# Altium schematic sheet IO_Peripherals.SchDoc: Peripherals
size A4; Date: Not used; ApprovedBy: Not used; CheckedBy: Not used; Author: Not used; CompanyName: STMicroelectronics; DrawnBy: Not used; Engineer: Not used; Organization: Not used; Address1: Not used; Address2: Not used; Address3: Not used; Address4: Not used; Revision: Not used; SheetNumber: 7; SheetTotal: 8; CurrentTime: Not used; CurrentDate: Not used; Time: Not used; DocumentFullPathAndName: Not used; DocumentName: Not used; ModifiedDate: Not used; ImagePath: Not used; ProjectName: Not used; Application_BuildNumber: Not used
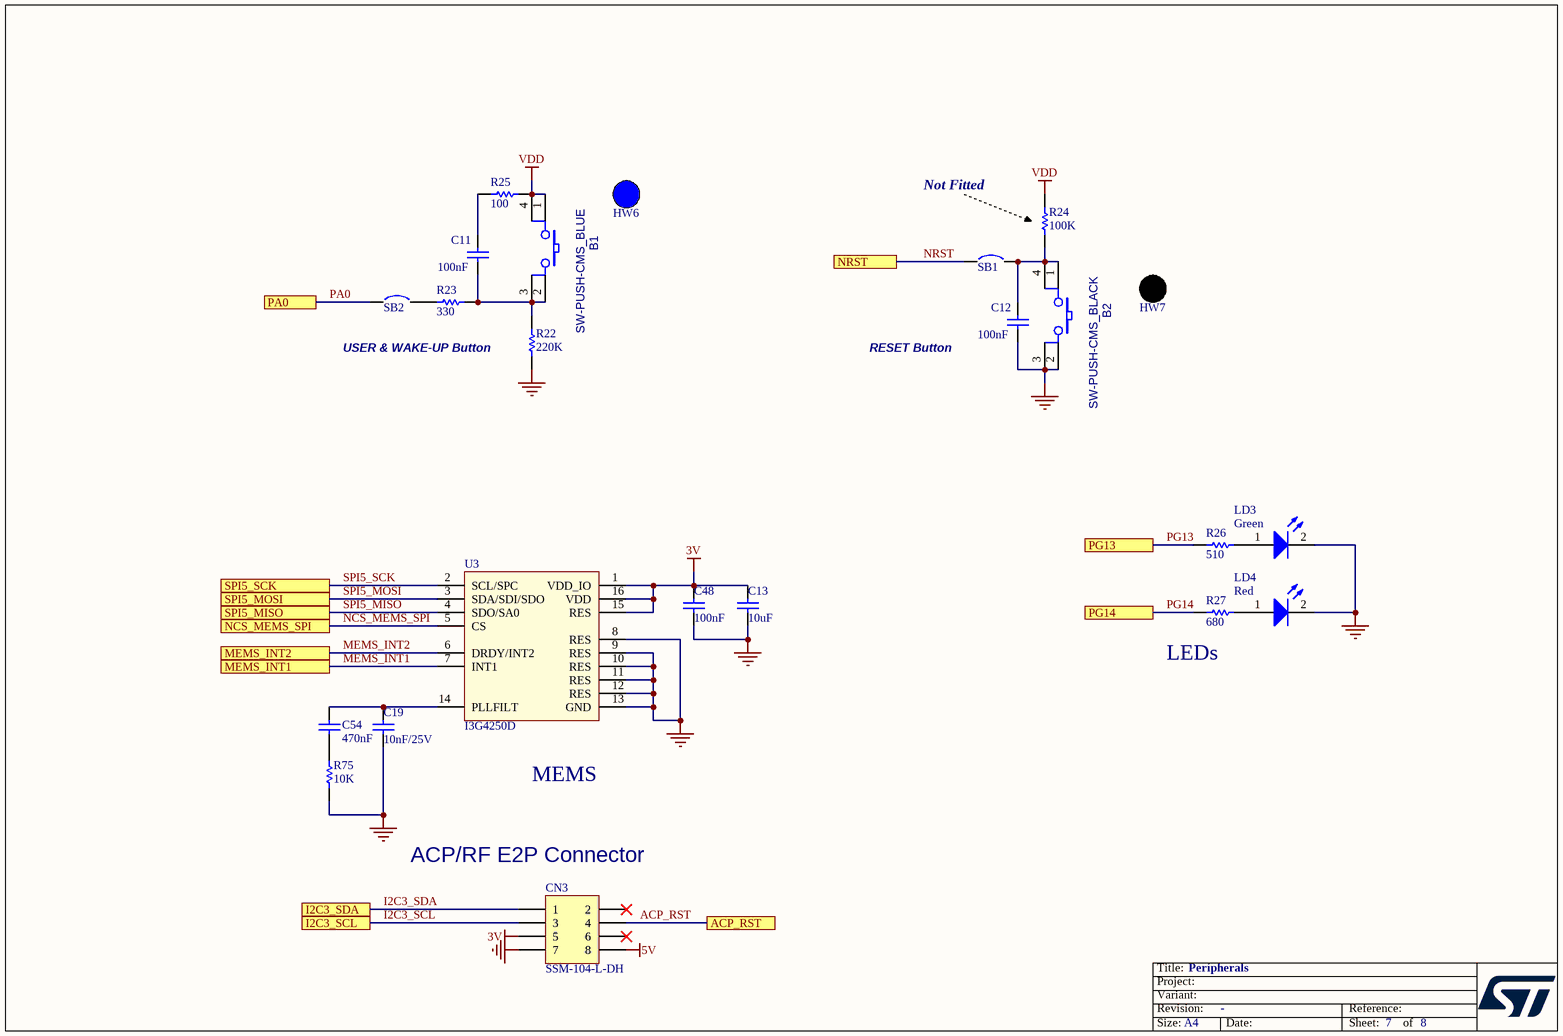
[diagram p0: IO_Peripherals.SchDoc]

## Parts
B1  SW-PUSH-CMS_BLUE  [BP1CMS]
B2  SW-PUSH-CMS_BLACK  [BP1CMS]
C11  100nF  [0402C]
C12  100nF  [0402C]
C13  10uF  [0603C]
C19  10nF/25V  [0603C]
C48  100nF  [0402C]
C54  value 470nF  [C0603]  (hidden comment: Capacitor)
CN3  SSM-104-L-DH  [SSM-104-L-DH]
HW6  BUTTON_HAT_BLUE  (value not drawn)  (mechanical)
HW7  BUTTON_HAT_BLACK  (value not drawn)  (mechanical)
LD3  Green  [0603D]
LD4  Red  [0603D]
R22  220K  [0402R]
R23  330  [0402R]
R24  100K  [0402R]
R25  100  [0402R]
R26  510  [0603R]
R27  680  [0603R]
R75  10K  [0402R]
SB1  Circuit Breaker  [JP2_SMD]  (value not drawn)
SB2  Circuit Breaker  [JP2_SMD]  (value not drawn)
U3  I3G4250D  [ICC_LGA16_4X4_P065_H1P1]

## Ports
ACP_RST, I2C3_SCL, I2C3_SDA, MEMS_INT1, MEMS_INT2, NCS_MEMS_SPI, NRST, PA0, PG13, PG14, SPI5_MISO, SPI5_MOSI, SPI5_SCK

## Nets
3V: C13.2 C48.2 CN3.5 U3.1(VDD_IO) U3.15(RES) U3.16(VDD)
5V: CN3.8
GND: B2.2 B2.3 C12.1 C13.1 C19.1 C48.1 CN3.7 LD3.2(K) LD4.2(K) R22.1 R75.1 U3.8(RES) U3.9(RES) U3.10(RES) U3.11(RES) U3.12(RES) U3.13(GND)
VDD: B1.1 B1.4 R24.2 R25.2
ACP_RST: CN3.4 ; port ACP_RST
I2C3_SCL: CN3.3 ; port I2C3_SCL
I2C3_SDA: CN3.1 ; port I2C3_SDA
MEMS_INT1: U3.7(INT1) ; port MEMS_INT1
MEMS_INT2: U3.6(DRDY/INT2) ; port MEMS_INT2
NCS_MEMS_SPI: U3.5(CS) ; port NCS_MEMS_SPI
NRST: SB1.1 ; port NRST
PA0: SB2.1 ; port PA0
PG13: R26.1 ; port PG13
PG14: R27.1 ; port PG14
SPI5_MISO: U3.4(SDO/SA0) ; port SPI5_MISO
SPI5_MOSI: U3.3(SDA/SDI/SDO) ; port SPI5_MOSI
SPI5_SCK: U3.2(SCL/SPC) ; port SPI5_SCK
NetB1_2: B1.2 B1.3 C11.1 R22.2 R23.2
NetB2_1: B2.1 B2.4 C12.2 R24.1 SB1.2
NetC11_2: C11.2 R25.1
NetC19_2: C19.2 C54.2 U3.14(PLLFILT)
NetC54_1: C54.1 R75.2
NetLD3_1: LD3.1(A) R26.2
NetLD4_1: LD4.1(A) R27.2
NetR23_1: R23.1 SB2.2

Not connected (* = marked no-connect by the designer): CN3 2* 6*

## Notes on the sheet
- Not Fitted
- USER & WAKE-UP Button
- RESET Button
- (near R27) LEDs
- MEMS
- (near CN3) ACP/RF E2P Connector
- Title:
- Project:
- Size:
- Revision:
- Variant:
- A4
- -
- Date:
- Reference:
- Sheet:
- of

## Library data of the parts
B1 = SW-PUSH-CMS_BLUE: Non-Open Push-Button 0.1A 24V; Manuf_2: FARNELL; Manuf_Part_2: 535-930; Manuf_1: wealthmetal; Manuf_Part_1: TD0341X-G01-BLU; Ref St: 9180120; Distrib: *
B2 = SW-PUSH-CMS_BLACK: Non-Open Push-Button 0.1A 24V; Manuf_2: FARNELL; Manuf_Part_2: 535-930; Manuf_1: wealthmetal; Manuf_Part_1: TD0341X-G01-BLA; Ref St: 9180120; Distrib: *
C11 C12 C48 = Capacitor_ST: Capacitor 0402 / 0603 / 0805; Revision: July-2002: Re-released for DXP Platform.; Value: 100nF
C13 C19 = CAP: Capacitor; Value: 100nF; Published: 8-Jun-2000; Revision: July-2002: Re-released for DXP Platform.; Publisher: Altium Limited
C54 = MCD-01006: Capacitor, MLCC, 470nF, 16V, X7R, 10%, 0603, T=0.8mm; Manufacturer_Part_Number: CC0603KRX7R7BB474; Manufacturer: YAGEO; Alternate_Manufacturer_Part_Number: GCM155R71C104KA55D; Alternate_Manufacturer: MURATA; BMS_Part_Number: 9142003; Provided_By: SUBCO; Internal_Part_Number: MCD-01006; Status: Released; Part_Type: Capacitor; Package: C0603; ComponentLink1Description: Datasheet; ComponentLink1URL: http://tunmcdsvn.tun.st.com/Component_Datasheet_Library/Trunk/Capacitors/Yageo_Multilayer_Capacitor_X7R_series_100pF_to_22uF/; ECCN_US: N/A; ECCN_EU: N/A
CN3 = SSM-104-L-DH: Header, 5-Pin, Dual row; Revision: 17-Jul-2002: Re-released for DXP Platform.; Publisher: Altium Limited
LD3 LD4 = LED2: Typical RED, GREEN, YELLOW, AMBER GaAs LED; Published: 8-Jun-2000; Revision: July-2002: Re-released for DXP Platform.; Publisher: Altium Limited
R22-R27 = Resistor_ST: Resistor 0402 / 0603 / 0805; Value: 10K
R75 = Resistor_ST: Resistor 0402 / 0603 / 0805; Value: 10K
SB1 SB2 = Circuit Breaker: Solder: YES; Published: 24-Mar-1999; Revision: July-2002: Re-released for DXP Platform.; Publisher: Altium Limited
U3 = MCD-01963: MEMS motion sensor: 3-axis digital output gyroscope LG4-16 4x4mm; Part_Type: IC; Manufacturer: STMICROELECTRONICS; ECCN_US: EAR99; ECCN_EU: NEC; Provided_By: SUBCO with ST control; Internal_Part_Number: MCD-01963; Value: I3G4250D; Status: Checked; Manufacturer_Part_Number: I3G4250D; Package: LGA-16; ComponentLink1Description: Datasheet; ComponentLink1URL: http://tunmcdsvn.tun.st.com/Component_Datasheet_Library/Trunk/IC/STM_I3G4250D_MEMS_3_axis_gyroscope